# EAGLE design heater (EAGLE 9.0.0)
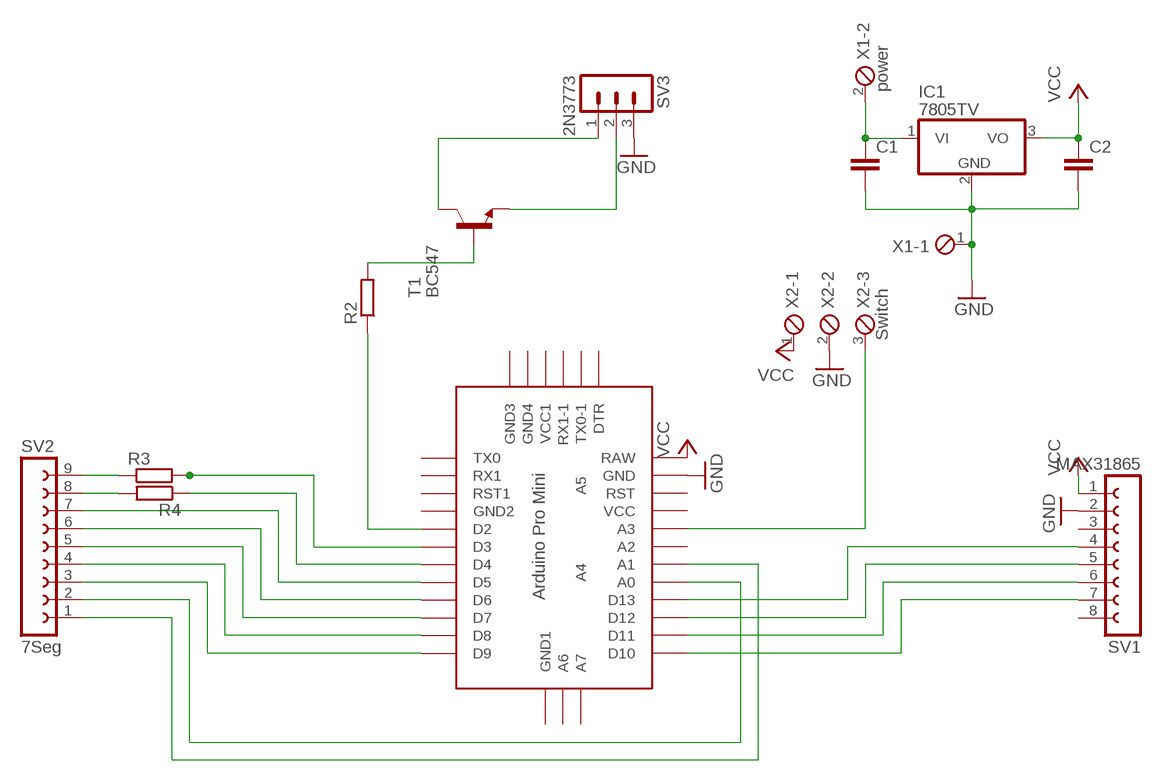
[diagram p0: schematic, sheet 1]

## Parts
C1  C-EU025-050X050  [C025-050X050]
C2  C-EU025-050X050  [C025-050X050]
IC1  7805TV  [TO220V]
R2  R-EU_0207/10  [0207/10]
R3  R-EU_0207/10  [0207/10]
R4  R-EU_0207/10  [0207/10]
SV1  MAX31865  FE08-1  [FE08]
SV2  7Seg  FE09-1  [FE09]
SV3  2N3773  MA03-1  [MA03-1]
T1  BC547  [TO92]
U$1  ABK-PRO-MINI  [ABK-PRO-MINI]
X1  power  MPT2  [2POL254]
X2  Switch  MPT3  [3POL254]

## Nets
GND: C1.2 C2.2 IC1.2(GND) SV1.2 SV3.3 U$1.GND X1.1 X2.2
N$1: C1.1 IC1.1(VI) X1.2
N$2: SV1.4 U$1.D13
N$3: SV1.5 U$1.D12
N$4: SV1.6 U$1.D11
N$5: SV1.7 U$1.D10
N$6: U$1.A3 X2.3
N$7: SV3.2 T1.1(E)
N$8: R2.2 T1.2(B)
N$9: SV3.1 T1.3(C)
N$10: R2.1 U$1.D2
N$11: R3.2 U$1.D3
N$12: SV2.2 U$1.A0
N$13: R4.2 SV2.8
N$14: R3.1 SV2.9
N$15: SV2.7 U$1.D5
N$16: SV2.6 U$1.D6
N$17: SV2.5 U$1.D7
N$18: SV2.4 U$1.D8
N$19: SV2.3 U$1.D9
N$20: SV2.1 U$1.A1
N$22: R4.1 U$1.D4
VCC: C2.1 IC1.3(VO) SV1.1 U$1.RAW X2.1
Unconnected: SV1.3 SV1.8 U$1.A2 U$1.A4 U$1.A5 U$1.A6 U$1.A7 U$1.DTR U$1.GND1(GND2) U$1.GND2(GND3) U$1.GND3(GND4) U$1.GND4(GND1) U$1.RST U$1.RST1 U$1.RX1 U$1.RX1-1 U$1.TX0 U$1.TX0-1 U$1.VCC U$1.VCC1

## Library data of the parts
C1 C2 = rcl:C-EU: CAPACITOR, European symbol; SPICEPREFIX: C
IC1 = linear:78*: Positive VOLTAGE REGULATOR Source: http://cache.national.com/ds/LM/LM78L05.pdf http://www.fairchildsemi.com/ds/LM/LM7805.pdf
R2-R4 = resistor:R-EU_: RESISTOR, European symbol
SV1 = con-lsta:FE08-1: FEMALE HEADER; OC_FARNELL: unknown; OC_NEWARK: unknown
SV2 = con-lsta:FE09-1: FEMALE HEADER; OC_FARNELL: unknown; OC_NEWARK: unknown
SV3 = con-lstb:MA03-1: PIN HEADER; OC_FARNELL: unknown; OC_NEWARK: unknown
T1 = transistor:BC547: NPN TRANSISTOR
U$1 = Arduino-clone:ABK-PRO-MINI: ABK Pro-Mini Arduino Clone
X1 = con-phoenix-254:MPT2: PHOENIX CONNECTOR; OC_FARNELL: unknown; OC_NEWARK: unknown
X2 = con-phoenix-254:MPT3: PHOENIX CONNECTOR; OC_FARNELL: unknown; OC_NEWARK: unknown

## Board
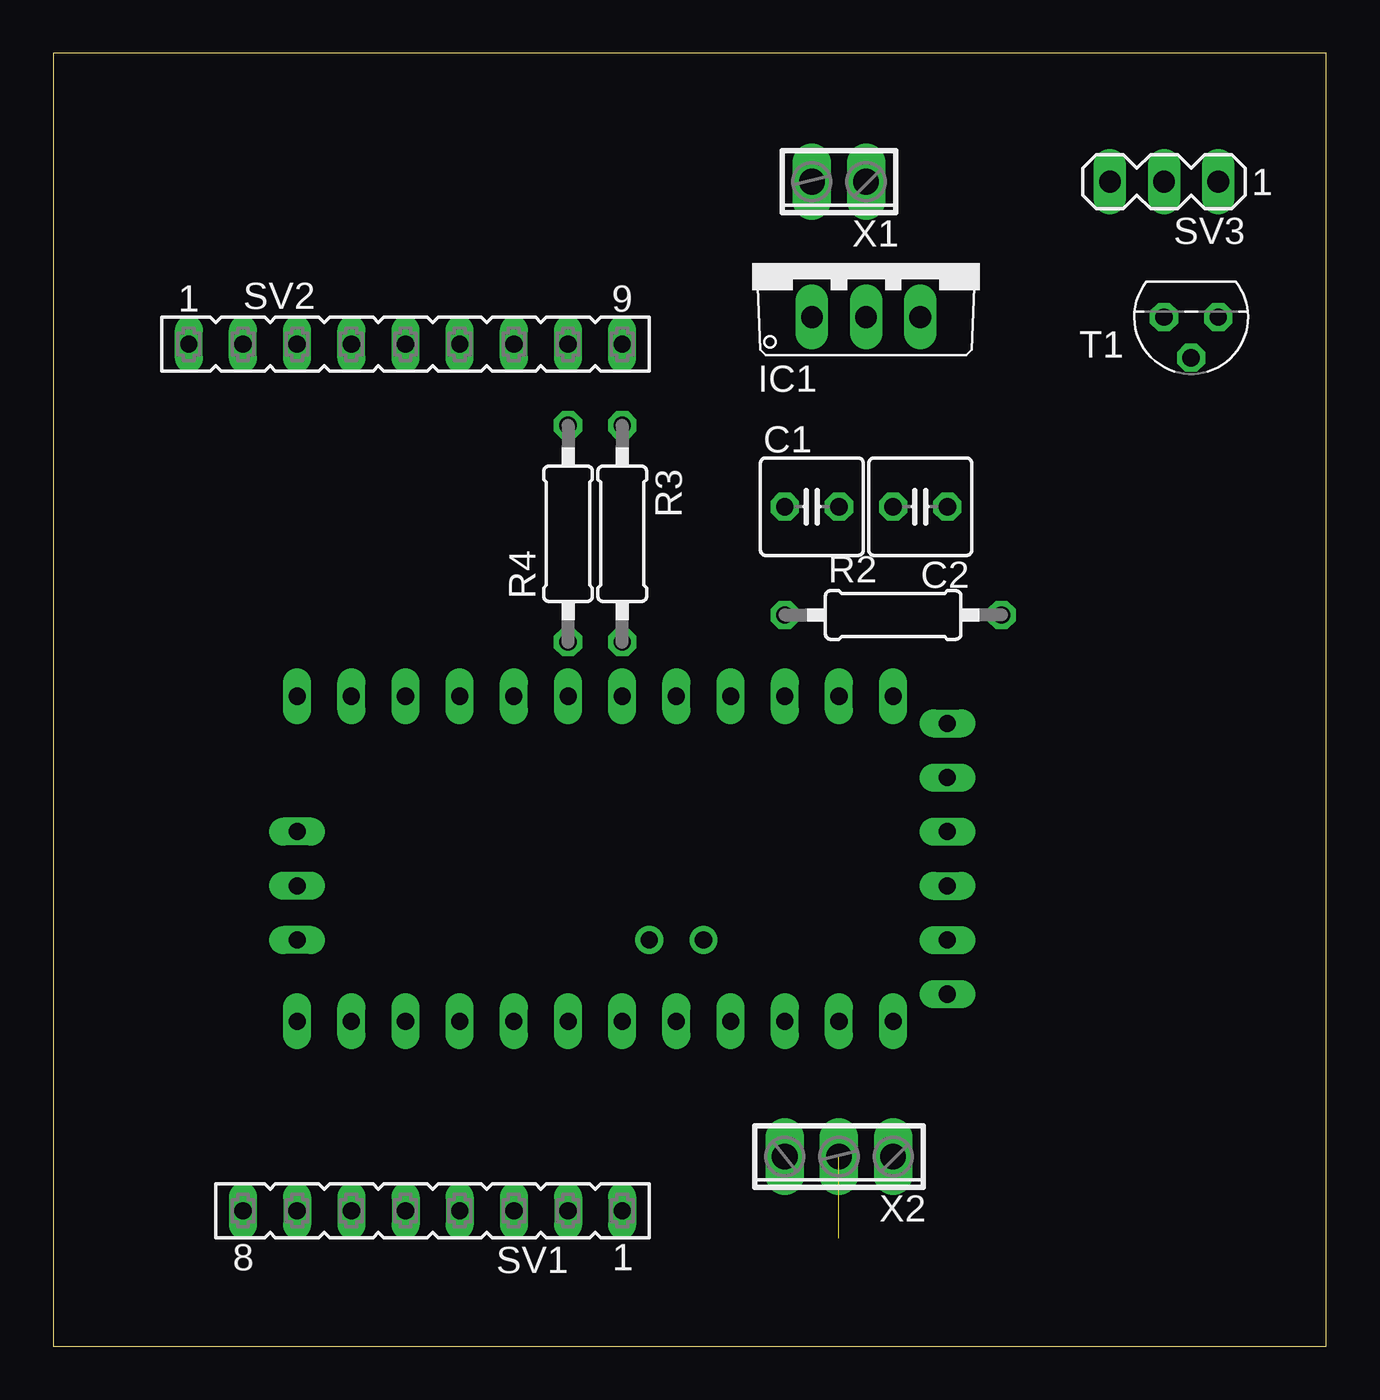
[diagram p1: board, top side]
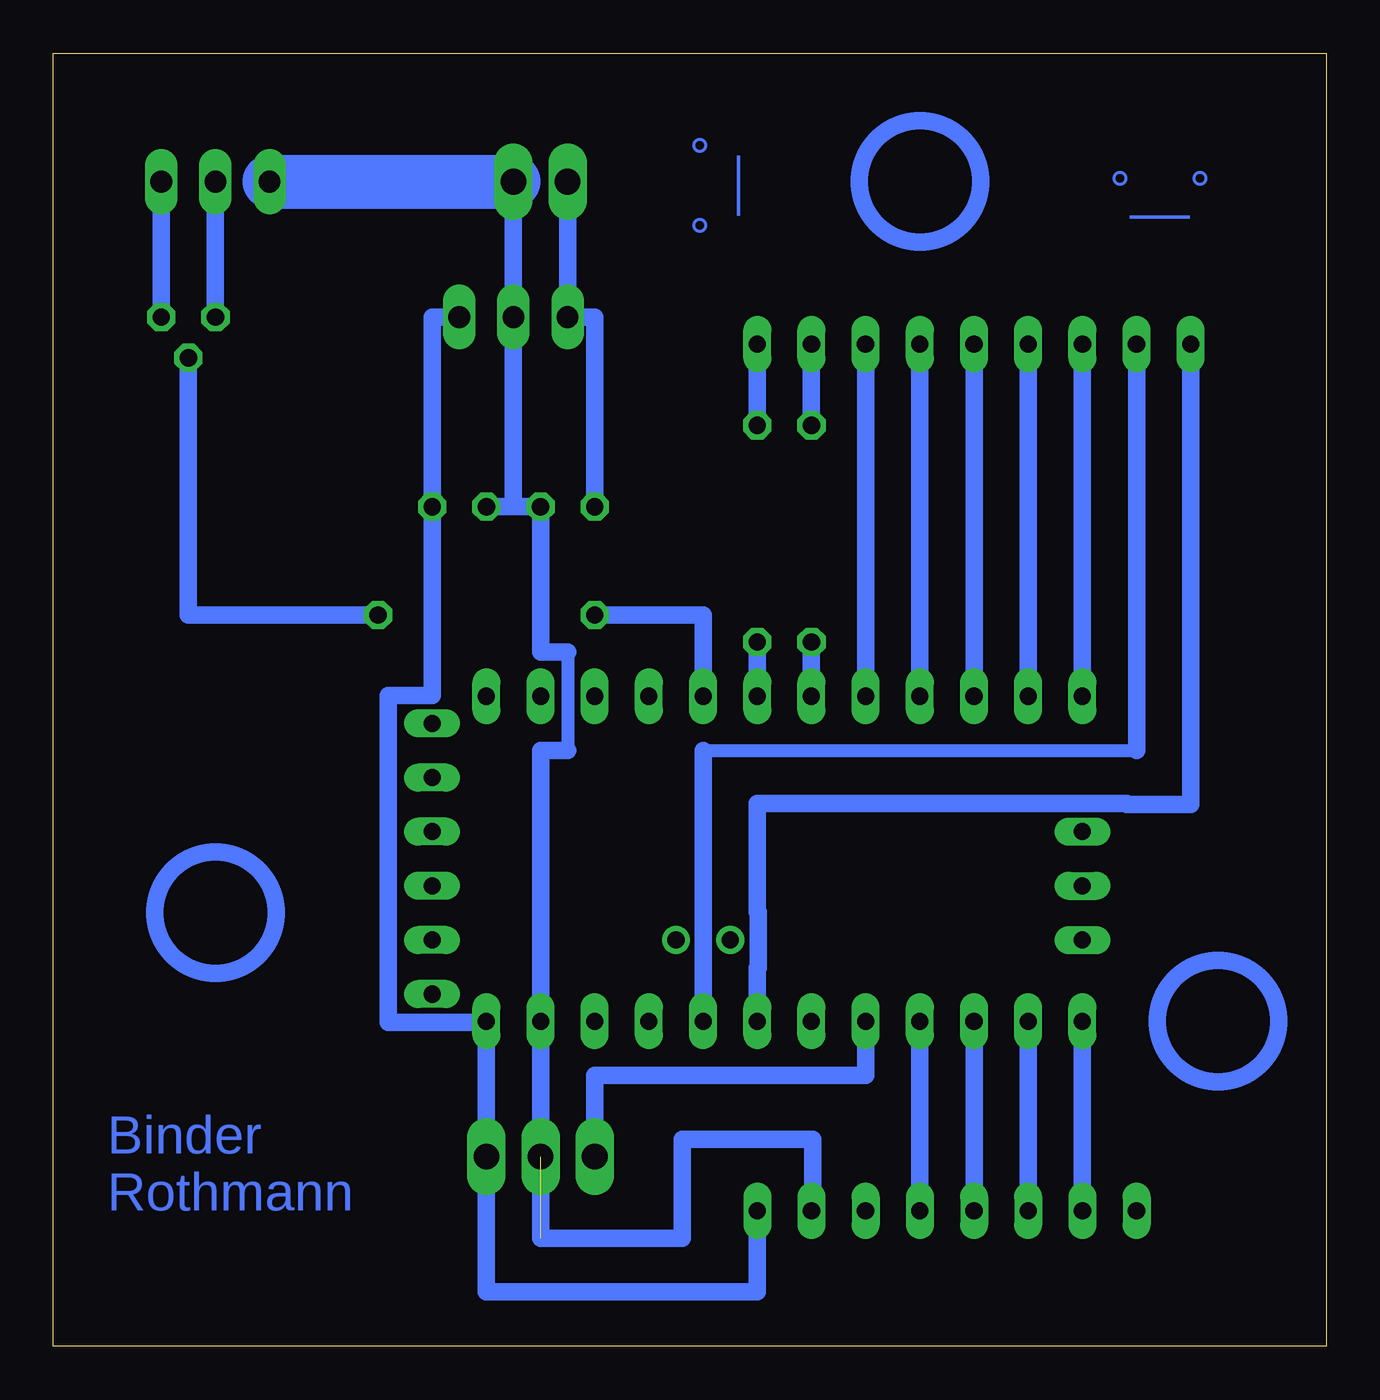
[diagram p2: board, bottom side, seen from below]

Size 59.67 x 60.63 mm. Coordinates in mm from the lower left corner, seen from the top.
Outline: 0,0 59.67,0 59.67,60.63 0,60.63 0,0
Copper layers (1*16): Top 0.035mm / dielectric 1.5mm / Bottom 0.035mm
Design rules "default": minimum track width 6mil, minimum drill 0.35mm, track to track 6mil, track to pad 6mil, pad to pad 6mil, via to via 6mil, smd to smd 6mil, copper to edge 40mil, drill to drill 6mil, minimum pad ring 10mil, minimum via ring 8mil, stop-mask expansion 4mil, vias tented up to drill 0mil, thermal gap 10mil

### Footprints (pad centres in the part's own frame; a part is rotated, then mirrored left to right if it is on the bottom)
C025-050X050 = drill 0.813 octagon: 1 -1.27,0; 2 1.27,0
TO220V = drill 1.016 long: 1 -2.54,-2.54; 2 0,-2.54; 3 2.54,-2.54
0207/10 = drill 0.813 octagon: 1 -5.08,0; 2 5.08,0
FE08 = drill 0.813 long: 1 -8.89,0; 2 -6.35,0; 3 -3.81,0; 4 -1.27,0; 5 1.27,0; 6 3.81,0; 7 6.35,0; 8 8.89,0
FE09 = drill 0.813 long: 1 -10.16,0; 2 -7.62,0; 3 -5.08,0; 4 -2.54,0; 5 0,0; 6 2.54,0; 7 5.08,0; 8 7.62,0; 9 10.16,0
MA03-1 = drill 1.016 long: 1 -2.54,0; 2 0,0; 3 2.54,0
TO92 = drill 0.813 octagon: 1 1.27,0; 2 0,1.905; 3 -1.27,0
ABK-PRO-MINI = drill 0.8 long: A0 10.16,-3.81; A1 10.16,-6.35; A2 10.16,-8.89; A3 10.16,-11.43; A6 3.81,-21.59; A7 6.35,-21.59; D2 -5.08,-3.81; D3 -5.08,-6.35; D4 -5.08,-8.89; D5 -5.08,-11.43; D6 -5.08,-13.97; D7 -5.08,-16.51; D8 -5.08,-19.05; D9 -5.08,-21.59; D10 10.16,-21.59; D11 10.16,-19.05; D12 10.16,-16.51; D13 10.16,-13.97; DTR 8.89,8.89; GND 10.16,3.81; GND1 -5.08,-1.27; GND2 -3.81,8.89; GND3 -1.27,8.89; GND4 1.27,-21.59; RAW 10.16,6.35; RST 10.16,1.27; RST1 -5.08,1.27; RX1 -5.08,3.81; RX1-1 3.81,8.89; TX0 -5.08,6.35; TX0-1 6.35,8.89; VCC 10.16,-1.27; VCC1 1.27,8.89 | drill 0.8: A4 6.35,-5.08; A5 6.35,-2.54
2POL254 = drill 1.2 long: 1 -1.27,0; 2 1.27,0
3POL254 = drill 1.2 long: 1 -2.54,0; 2 0,0; 3 2.54,0

### Placement (x,y rotation side)
C1  35.56,39.37 0 top
C2  40.64,39.37 180 top
IC1  38.1,50.8 0 top
R2  39.37,34.29 0 top
R3  26.67,38.1 270 top
R4  24.13,38.1 90 top
SV1  17.78,6.35 180 top
SV2  16.51,46.99 0 top
SV3  52.07,54.61 180 top
T1  53.34,48.26 180 top
U$1  33.02,25.4 270 top
X1  36.83,54.61 180 top
X2  36.83,8.89 180 top

### Tracks (layer width: path | path; a pad name or v marks a point on that pad's centre or on a via)
GND  (1 unrouted)
  Bottom 0.61: 35.56,32.55 35.56,27.94
  Bottom 0.813: X1.1 IC1.2 38.1,39.37 C1.2 | C1.2 C2.2 | C1.2 36.83,32.55 35.56,32.55 | 35.56,27.94 36.83,27.94 U$1.GND 36.83,5.06 30.19,5.06 30.19,9.7 24.08,9.7 24.08,6.35 SV1.2
  Bottom 2.54: SV3.3 X1.1
N$1
  Bottom 0.813: X1.2 IC1.1 34.29,48.26 C1.1
N$2
  Bottom 0.813: SV1.4 U$1.D13
N$3
  Bottom 0.813: SV1.5 U$1.D12
N$4
  Bottom 0.813: U$1.D11 SV1.6
N$5
  Bottom 0.813: SV1.7 U$1.D10
N$6
  Bottom 0.813: U$1.A3 21.59,12.7 34.29,12.7 X2.3
N$7
  Bottom 0.813: SV3.2 T1.1
N$8
  Bottom 0.813: R2.2 53.34,34.29 T1.2
N$9
  Bottom 0.813: T1.3 SV3.1
N$10
  Bottom 0.813: U$1.D2 29.21,34.29 R2.1
N$11
  Bottom 0.813: U$1.D3 R3.2
N$12
  Bottom 0.61: 29.21,27.94 8.89,27.94
  Bottom 0.813: U$1.A0 29.21,27.94 | 8.89,27.94 SV2.2
N$13
  Bottom 0.813: SV2.8 R4.2
N$14
  Bottom 0.813: R3.1 SV2.9
N$15
  Bottom 0.813: U$1.D5 SV2.7
N$16
  Bottom 0.813: SV2.6 U$1.D6
N$17
  Bottom 0.813: U$1.D7 SV2.5
N$18
  Bottom 0.813: U$1.D8 SV2.4
N$19
  Bottom 0.813: U$1.D9 SV2.3
N$20
  Bottom 0.813: U$1.A1 26.67,17.74 26.63,17.74 26.63,20.36 26.67,20.36 26.67,25.44 9.36,25.44 9.36,25.4 6.35,25.4 SV2.1
N$22
  Bottom 0.813: R4.1 U$1.D4
VCC
  Bottom 0.813: IC1.3 41.91,48.26 C2.1 41.91,30.52 43.98,30.52 43.98,15.2 39.84,15.2 | 39.84,15.2 39.37,15.2 X2.1 39.37,2.54 26.67,2.54 SV1.1 | 39.84,15.2 39.84,15.24 U$1.RAW
(copper drawn outside any net)
  shapes: Bottom circle x3

### Text on the board
Bottom: °__° | °__° | Binder / Rothmann